# Altium schematic sheet STM32.SchDoc
size A3
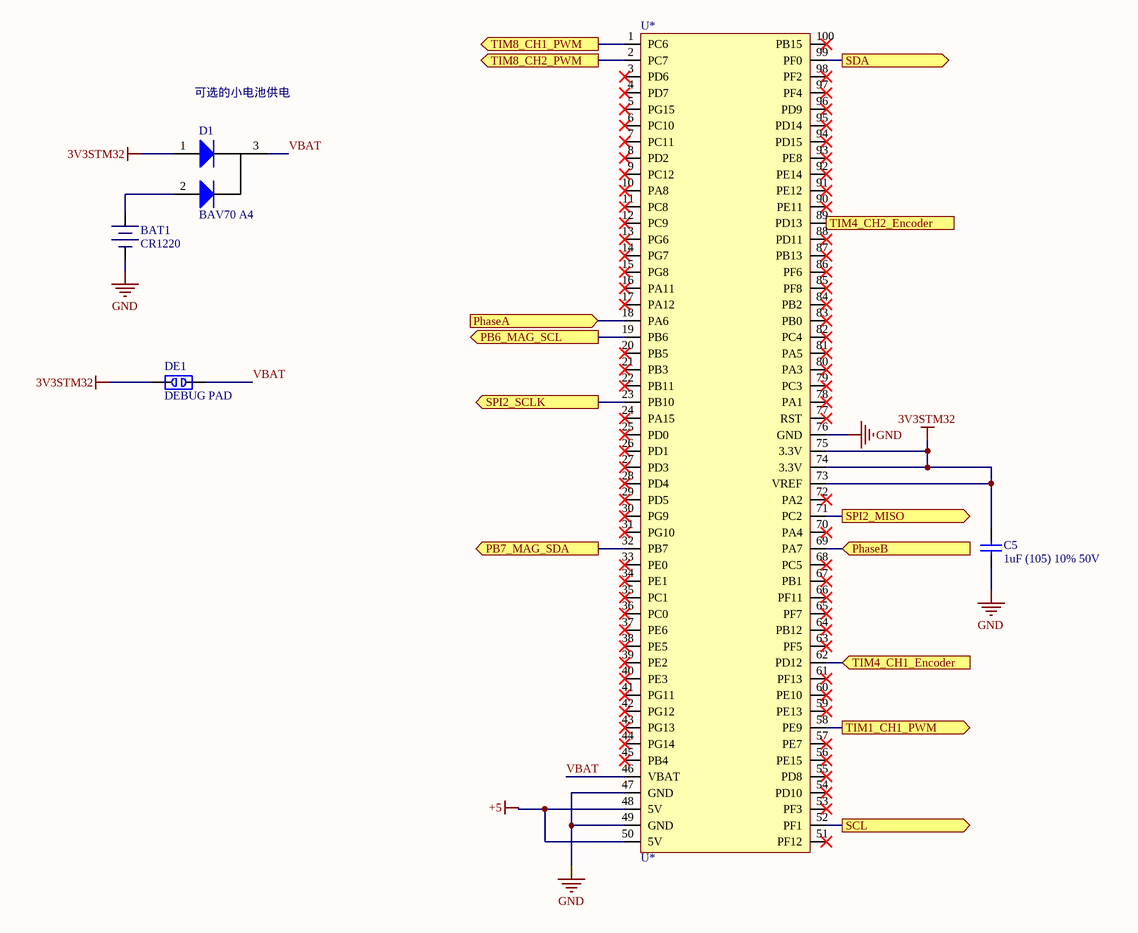
[diagram p0: STM32.SchDoc]

## Parts
BAT1  CR1220  [CR1220-A]
C5  1uF (105) 10% 50V  [0603_C]
D1  BAV70 A4  [SOT-23(SOT-23-3)]
DE1  DEBUG PAD  [DEBUG_B]
U*  U*  [STM32F407MiniBoard]

## Ports
PB6_MAG_SCL (out), PB7_MAG_SDA (out), PhaseA (in), PhaseB (in), SCL (out), SDA (out), SPI2_MISO (out), SPI2_SCLK (out), TIM1_CH1_PWM (out), TIM4_CH1_Encoder (in), TIM4_CH2_Encoder (in), TIM8_CH1_PWM (out), TIM8_CH2_PWM (out)

## Nets
3V3STM32: C5.2 D1.1(A) DE1.1 U*.73(VREF) U*.74(3.3V) U*.75(3.3V)
+5: U*.48(5V) U*.50(5V)
GND: BAT1.2 C5.1 U*.47(GND) U*.49(GND) U*.76(GND)
PB6_MAG_SCL: U*.19(PB6) ; port PB6_MAG_SCL
PB7_MAG_SDA: U*.32(PB7) ; port PB7_MAG_SDA
PhaseA: U*.18(PA6) ; port PhaseA
PhaseB: U*.69(PA7) ; port PhaseB
SCL: U*.52(PF1) ; port SCL
SDA: U*.99(PF0) ; port SDA
SPI2_MISO: U*.71(PC2) ; port SPI2_MISO
SPI2_SCLK: U*.23(PB10) ; port SPI2_SCLK
TIM1_CH1_PWM: U*.58(PE9) ; port TIM1_CH1_PWM
TIM4_CH1_Encoder: U*.62(PD12) ; port TIM4_CH1_Encoder
TIM4_CH2_Encoder: U*.89(PD13) ; port TIM4_CH2_Encoder
TIM8_CH1_PWM: U*.1(PC6) ; port TIM8_CH1_PWM
TIM8_CH2_PWM: U*.2(PC7) ; port TIM8_CH2_PWM
VBAT: D1.3(K) DE1.2 U*.46(VBAT)
NetBAT1_1: BAT1.1 D1.2(A)

Not connected (* = marked no-connect by the designer): U* 3(PD6)* 4(PD7)* 5(PG15)* 6(PC10)* 7(PC11)* 8(PD2)* 9(PC12)* 10(PA8)* 11(PC8)* 12(PC9)* 13(PG6)* 14(PG7)* 15(PG8)* 16(PA11)* 17(PA12)* 20(PB5)* 21(PB3)* 22(PB11)* 24(PA15)* 25(PD0)* 26(PD1)* 27(PD3)* 28(PD4)* 29(PD5)* 30(PG9)* 31(PG10)* 33(PE0)* 34(PE1)* 35(PC1)* 36(PC0)* 37(PE6)* 38(PE5)* 39(PE2)* 40(PE3)* 41(PG11)* 42(PG12)* 43(PG13)* 44(PG14)* 45(PB4)* 51(PF12)* 53(PF3)* 54(PD10)* 55(PD8)* 56(PE15)* 57(PE7)* 59(PE13)* 60(PE10)* 61(PF13)* 63(PF5)* 64(PB12)* 65(PF7)* 66(PF11)* 67(PB1)* 68(PC5)* 70(PA4)* 72(PA2)* 77(RST)* 78(PA1)* 79(PC3)* 80(PA3)* 81(PA5)* 82(PC4)* 83(PB0)* 84(PB2)* 85(PF8)* 86(PF6)* 87(PB13)* 88(PD11)* 90(PE11)* 91(PE12)* 92(PE14)* 93(PE8)* 94(PD15)* 95(PD14)* 96(PD9)* 97(PF4)* 98(PF2)* 100(PB15)*

## Notes on the sheet
- (near D1) 可选的小电池供电

## Library data of the parts
C5 = 0603 1uF (105) 10% 50V: 贴片电容; ComponentLink1Description: 供应商链接; ComponentLink1URL: http://www.szlcsc.com/product/details_16531.html; Package: 0603; Supplier: LC; SuppliersPartNumber: C15849
D1 = SOT-23 BAV70 A4: 开关二极管; ComponentLink1Description: 供应商链接; ComponentLink1URL: http://www.szlcsc.com/product/details_70091.html; Package: SOT-23; Supplier: LC; SuppliersPartNumber: C68978
DE1 = DEBUG: 调试断点焊盘; 版权归属: 源创客; BOM名称: 调试断点焊盘; 学习资源: www.ooocke.com
U* = STM32F407MiniBoard